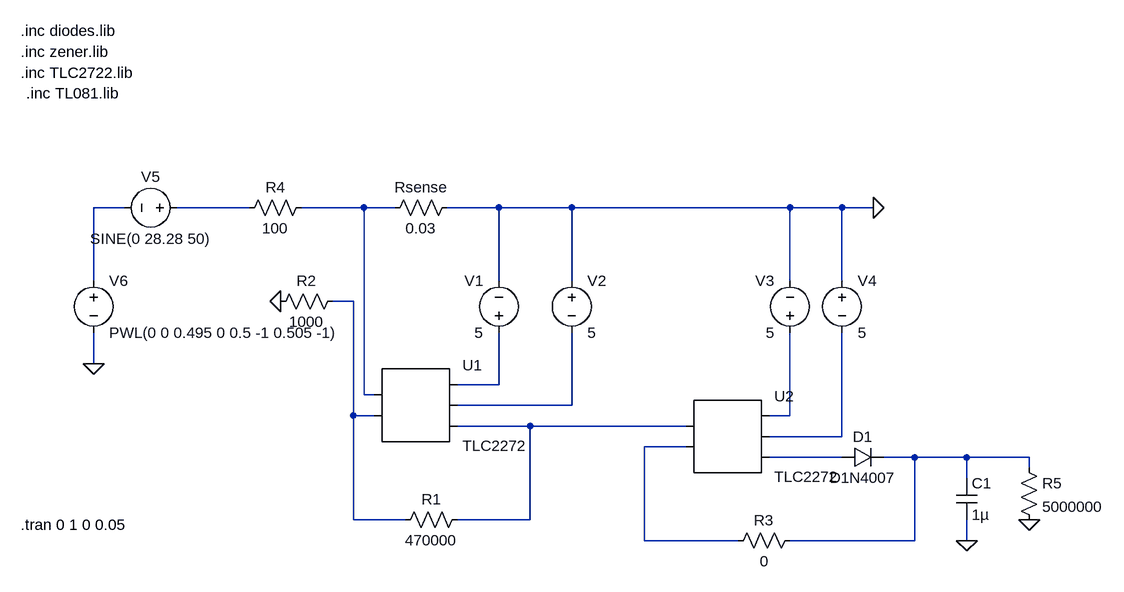
[diagram p0: schematic Draft4.asc]
Draft4.asc, the LTspice schematic file:
Version 4
SHEET 1 1248 980
WIRE -272 -80 -320 -80
WIRE -80 -80 -192 -80
WIRE 96 -80 0 -80
WIRE 144 -80 96 -80
WIRE 304 -80 224 -80
WIRE 416 -80 304 -80
WIRE 752 -80 416 -80
WIRE 832 -80 752 -80
WIRE 880 -80 832 -80
WIRE -320 32 -320 -80
WIRE 304 32 304 -80
WIRE 416 32 416 -80
WIRE 752 32 752 -80
WIRE 832 32 832 -80
WIRE 80 64 48 64
WIRE -320 160 -320 112
WIRE 304 192 304 112
WIRE 304 192 240 192
WIRE 96 208 96 -80
WIRE 112 208 96 208
WIRE 416 224 416 112
WIRE 416 224 240 224
WIRE 80 240 80 64
WIRE 112 240 80 240
WIRE 752 240 752 112
WIRE 752 240 720 240
WIRE 352 256 240 256
WIRE 592 256 352 256
WIRE 832 272 832 112
WIRE 832 272 720 272
WIRE 592 288 528 288
WIRE 832 304 720 304
WIRE 944 304 896 304
WIRE 1024 304 944 304
WIRE 1120 304 1024 304
WIRE 1120 320 1120 304
WIRE 1024 336 1024 304
WIRE 80 400 80 240
WIRE 160 400 80 400
WIRE 352 400 352 256
WIRE 352 400 240 400
WIRE 528 432 528 288
WIRE 672 432 528 432
WIRE 944 432 944 304
WIRE 944 432 752 432
WIRE 1024 432 1024 400
FLAG -32 64 0
FLAG 880 -80 0
FLAG 1024 432 0
FLAG -320 160 0
FLAG 1120 400 0
SYMBOL res 128 -64 R270
WINDOW 0 32 56 VTop 2
WINDOW 3 0 56 VBottom 2
SYMATTR InstName Rsense
SYMATTR Value 0.03
SYMBOL res -96 -64 R270
WINDOW 0 32 56 VTop 2
WINDOW 3 0 56 VBottom 2
SYMATTR InstName R4
SYMATTR Value 100
SYMBOL res 144 416 R270
WINDOW 0 32 56 VTop 2
WINDOW 3 0 56 VBottom 2
SYMATTR InstName R1
SYMATTR Value 470000
SYMBOL res -48 80 R270
WINDOW 0 32 56 VTop 2
WINDOW 3 0 56 VBottom 2
SYMATTR InstName R2
SYMATTR Value 1000
SYMBOL voltage 304 128 R180
WINDOW 0 24 96 Left 2
WINDOW 3 24 16 Left 2
WINDOW 123 0 0 Left 2
WINDOW 39 0 0 Left 2
SYMATTR InstName V1
SYMATTR Value 5
SYMBOL diode 832 320 R270
WINDOW 0 32 32 VTop 2
WINDOW 3 0 32 VBottom 2
SYMATTR InstName D1
SYMATTR Value D1N4007
SYMBOL voltage 752 128 R180
WINDOW 0 24 96 Left 2
WINDOW 3 24 16 Left 2
WINDOW 123 0 0 Left 2
WINDOW 39 0 0 Left 2
SYMATTR InstName V3
SYMATTR Value 5
SYMBOL voltage 832 16 R0
WINDOW 123 0 0 Left 2
WINDOW 39 0 0 Left 2
SYMATTR InstName V4
SYMATTR Value 5
SYMBOL cap 1008 336 R0
SYMATTR InstName C1
SYMATTR Value 1µ
SYMBOL voltage -176 -80 R90
WINDOW 0 -32 56 VBottom 2
WINDOW 3 32 56 VTop 2
WINDOW 123 0 0 Left 2
WINDOW 39 0 0 Left 2
SYMATTR InstName V5
SYMATTR Value SINE(0 28.28 50)
SYMBOL voltage 416 16 R0
WINDOW 123 0 0 Left 2
WINDOW 39 0 0 Left 2
SYMATTR InstName V2
SYMATTR Value 5
SYMBOL res 656 448 R270
WINDOW 0 32 56 VTop 2
WINDOW 3 0 56 VBottom 2
SYMATTR InstName R3
SYMATTR Value 0
SYMBOL AutoGenerated\\TLC2272 176 224 R0
SYMATTR InstName U1
SYMBOL AutoGenerated\\TLC2272 656 272 R0
SYMATTR InstName U2
SYMBOL voltage -320 16 R0
WINDOW 123 0 0 Left 2
WINDOW 39 0 0 Left 2
SYMATTR InstName V6
SYMATTR Value PWL(0 0 0.495 0 0.5 -1 0.505 -1)
SYMBOL res 1104 304 R0
SYMATTR InstName R5
SYMATTR Value 5000000
TEXT -432 -352 Left 2 !.inc diodes.lib
TEXT -432 408 Left 2 !.tran 0 1 0 0.05
TEXT -432 -320 Left 2 !.inc zener.lib
TEXT -424 -256 Left 2 !.inc TL081.lib
TEXT -432 -288 Left 2 !.inc TLC2722.lib

The netlist it stands for:
* Draft4.asc
Rsense N003 0 0.03
R4 N002 N003 100
R1 N004 N008 470000
R2 0 N004 1000
V1 N005 0 5
D1 N011 N012 D1N4007
V3 N007 0 5
V4 0 N009 5
C1 N012 0 1µ
V5 N002 N001 SINE(0 28.28 50)
V2 0 N006 5
R3 N010 N012 0
* U1: TLC2272 (symbol AutoGenerated\TLC2272 not available, pins judged from their places): pin1=N003 pin2=N004 pin3=N005 pin4=N006 pin5=N008
* U2: TLC2272 (symbol AutoGenerated\TLC2272 not available, pins judged from their places): pin1=N008 pin2=N010 pin3=N007 pin4=N009 pin5=N011
V6 N001 0 PWL(0 0 0.495 0 0.5 -1 0.505 -1)
R5 N012 0 5000000
.model D D
.lib standard.dio
.inc diodes.lib
.tran 0 1 0 0.05
.inc zener.lib
.inc TL081.lib
.inc TLC2722.lib
.backanno
.end